# EAGLE design top-v1.0r32 (EAGLE 9.5.2)
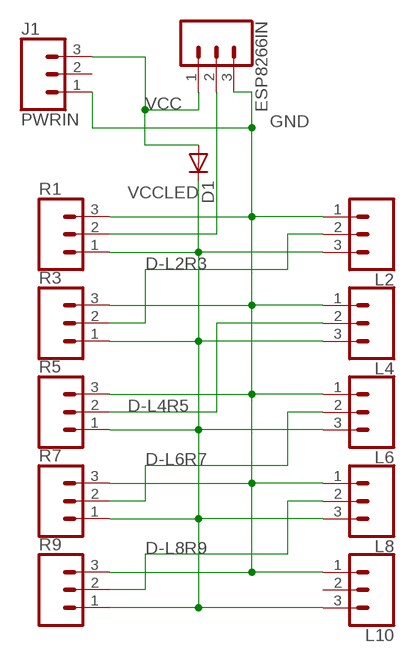
[diagram p0: schematic, sheet 1]

## Parts
D1  1N4004  [DO41-10]
ESP8266IN  CONN_03  [1X03]
J1  PWRIN  CONN_03  [1X03]
L2  CONN_03  [1X03]
L4  CONN_03  [1X03]
L6  CONN_03  [1X03]
L8  CONN_03  [1X03]
L10  CONN_03  [1X03]
R1  CONN_03  [1X03]
R3  CONN_03  [1X03]
R5  CONN_03  [1X03]
R7  CONN_03  [1X03]
R9  CONN_03  [1X03]

## Nets
D-INR1 [DATA]: ESP8266IN.2 R1.2
D-L2R3 [DATA]: L2.2 R3.2
D-L4R5 [DATA]: L4.2 R5.2
D-L6R7 [DATA]: L6.2 R7.2
D-L8R9 [DATA]: L8.2 R9.2
GND [PWR]: ESP8266IN.3 J1.1 L2.1 L4.1 L6.1 L8.1 L10.1 R1.3 R3.3 R5.3 R7.3 R9.3
VCC [PWR]: D1.A ESP8266IN.1 J1.3
VCCLED [PWR]: D1.C L2.3 L4.3 L6.3 L8.3 L10.3 R1.1 R3.1 R5.1 R7.1 R9.1
Unconnected: J1.2 L10.2

## Library data of the parts
D1 = _mod_diode:1N4004: DIODE general purpose rectifier, 1 A
ESP8266IN J1 = SparkFun-Connectors:CONN_03: Multi connection point. Often used as Generic Header-pin footprint for 0.1 inch spaced/style header connections On any of the 0.1 inch spaced packages, you can populate with these: Break Away Headers - Straight <https://www.sparkfun.com/products/116> (PRT-00116) Break Away Male Headers - Right Angle <https://www.sparkfun.com/products/553> (PRT-00553) Female Headers <https://www.sparkfun.com/products/115> (PRT-00115) Break Away Headers - Machine Pin <https://www.sparkfun.com/products/117> (PRT-00117) Break Away Female Headers - Swiss Machine Pin <https://www.sparkfun.com/products/743> (PRT-00743) Stackable Header - 3 Pin (Female, 0.1") <https://www.sparkfun.com/products/13875> (PRT-13875) For SCREWTERMINALS and SPRING TERMINALS visit here: Screw Terimnals on SparkFun.com <https://www.sparkfun.com/search/results?term=Screw+Terminals> (5mm/3.5mm/2.54mm spacing) This device is also useful as a general connection point to wire up your design to another part of your project. Our various solder wires solder well into these plated through hole pads. Hook-Up Wire - Assortment (Stranded, 22 AWG) <https://www.sparkfun.com/products/11375> (PRT-11375) Hook-Up Wire - Assortment (Solid Core, 22 AWG) <https://www.sparkfun.com/products/11367> (PRT-11367) View the entire wire category on our website here <https://www.sparkfun.com/categories/141> Special notes: Molex polarized connector foot print use with SKU : PRT-08232 with associated crimp pins and housings.; PROD_ID: XXX-00000; VALUE: 455-1750-1-ND
L2 L4 L6 L8 L10 R1 R3 R5 R7 R9 = SparkFun-Connectors:CONN_03: Multi connection point. Often used as Generic Header-pin footprint for 0.1 inch spaced/style header connections On any of the 0.1 inch spaced packages, you can populate with these: Break Away Headers - Straight <https://www.sparkfun.com/products/116> (PRT-00116) Break Away Male Headers - Right Angle <https://www.sparkfun.com/products/553> (PRT-00553) Female Headers <https://www.sparkfun.com/products/115> (PRT-00115) Break Away Headers - Machine Pin <https://www.sparkfun.com/products/117> (PRT-00117) Break Away Female Headers - Swiss Machine Pin <https://www.sparkfun.com/products/743> (PRT-00743) Stackable Header - 3 Pin (Female, 0.1") <https://www.sparkfun.com/products/13875> (PRT-13875) For SCREWTERMINALS and SPRING TERMINALS visit here: Screw Terimnals on SparkFun.com <https://www.sparkfun.com/search/results?term=Screw+Terminals> (5mm/3.5mm/2.54mm spacing) This device is also useful as a general connection point to wire up your design to another part of your project. Our various solder wires solder well into these plated through hole pads. Hook-Up Wire - Assortment (Stranded, 22 AWG) <https://www.sparkfun.com/products/11375> (PRT-11375) Hook-Up Wire - Assortment (Solid Core, 22 AWG) <https://www.sparkfun.com/products/11367> (PRT-11367) View the entire wire category on our website here <https://www.sparkfun.com/categories/141> Special notes: Molex polarized connector foot print use with SKU : PRT-08232 with associated crimp pins and housings.

## Net classes
1 PWR: width 1 mm
3 DATA: width 0.5 mm

## Board
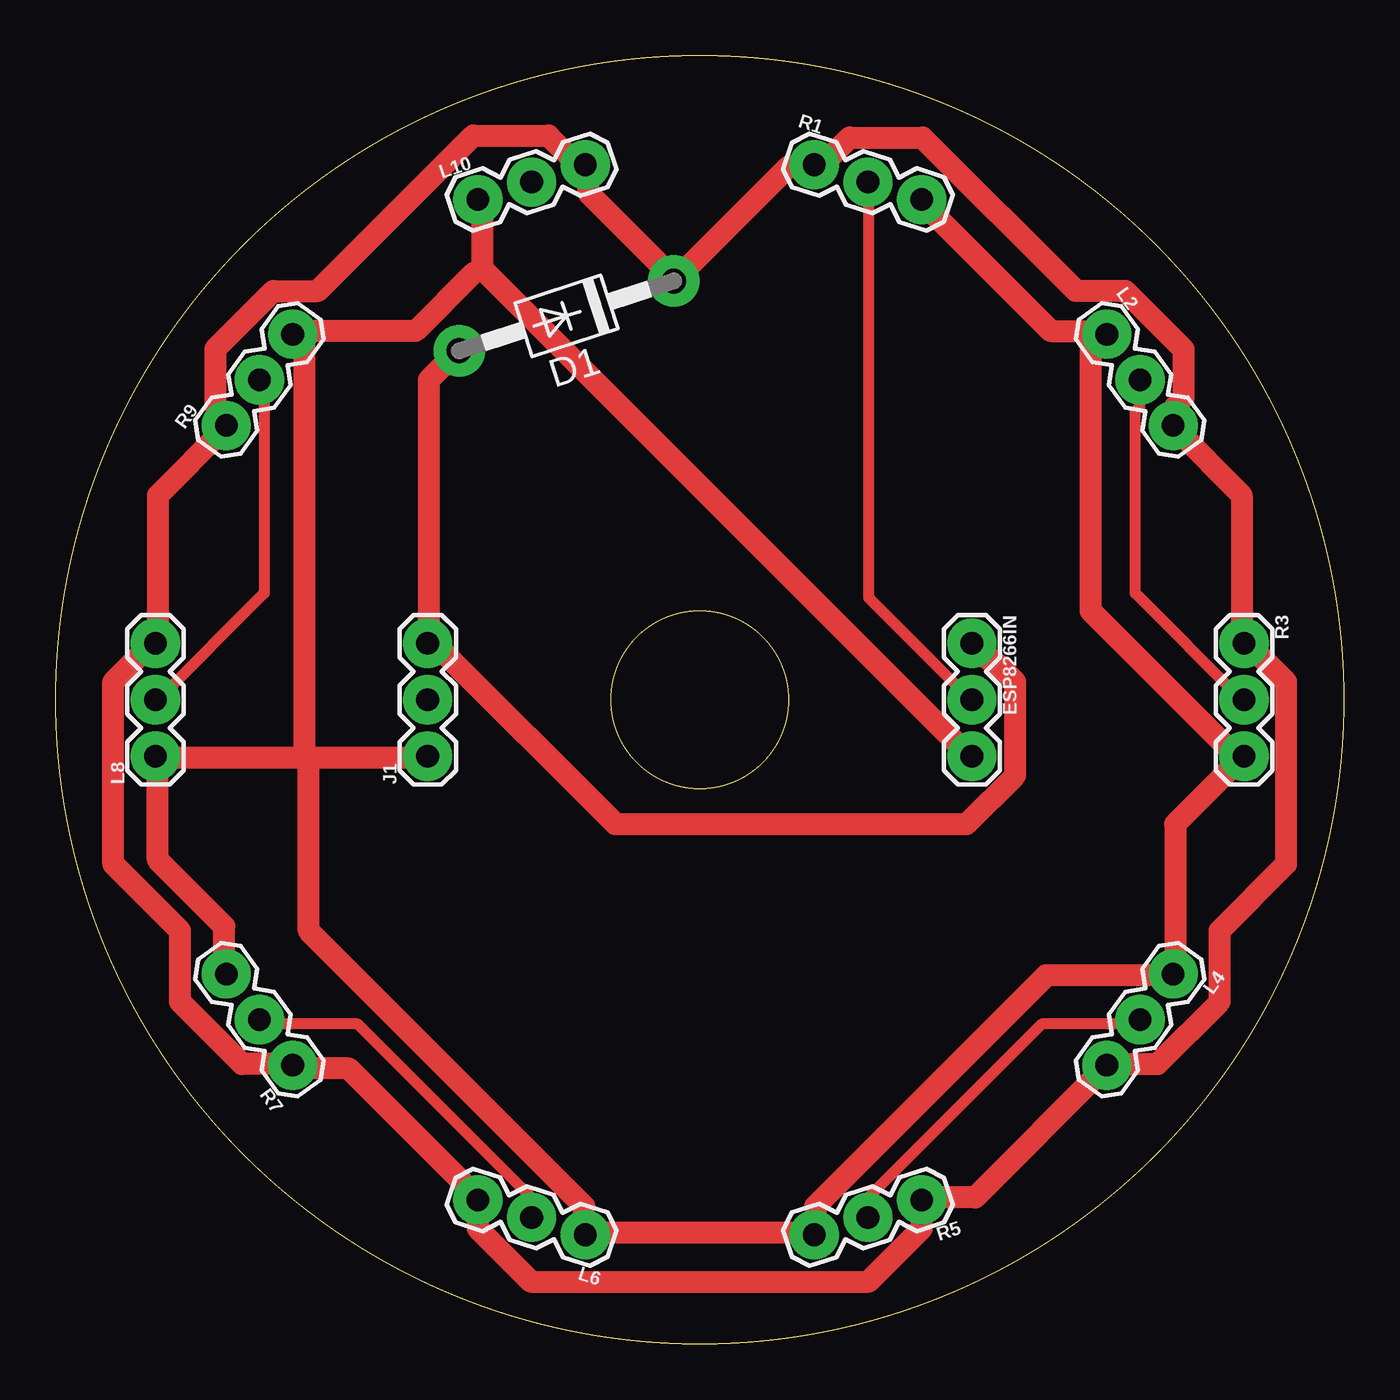
[diagram p1: board, top side]

Size 58 x 58 mm. Coordinates in mm from the lower left corner, seen from the top.
Outline: circle at 29,29 radius 29
Outline: circle at 29,29 radius 4
Copper layers 1: Top 0.035mm
Design rules "default *": minimum track width 0.3mm, minimum drill 1mm, track to track 0.5mm, track to pad 0.25mm, pad to pad 0.15mm, via to via 0.25mm, smd to smd 0.05mm, copper to edge 40mil, drill to drill 6mil, minimum pad ring 0.6mm, minimum via ring 8mil, stop-mask expansion 4mil, vias tented up to drill 0mil, thermal gap 10mil

### Footprints (pad centres in the part's own frame; a part is rotated, then mirrored left to right if it is on the bottom)
DO41-10 = drill 1.118: A 5.08,0; C -5.08,0
1X03 = drill 1.016 pad 1.88: 1 0,0; 2 2.54,0; 3 5.08,0

### Placement (x,y rotation side)
D1  23,46.28 198 top
ESP8266IN  41.25,31.54 270 top
J1  16.75,26.46 90 top
L2  47.33,45.46 306 top
L4  50.31,16.65 234 top
L6  23.84,4.91 162 top
L8  4.5,26.46 90 top
L10  19.01,51.52 18 top
R1  34.16,53.09 342 top
R3  53.5,31.54 270 top
R5  38.99,6.48 198 top
R7  10.67,12.54 126 top
R9  7.69,41.35 54 top

### Tracks (layer width: path | path; a pad name or v marks a point on that pad's centre or on a via)
D-INR1
  Top 0.5: ESP8266IN.2 41.2,29 36.6,33.6 36.6,52.2 R1.2
D-L2R3
  Top 0.5: L2.2 48.8,43.4 48.8,42.2 48.6,42 48.6,33.8 53.4,29 R3.2
D-L4R5
  Top 0.5: R5.2 36.6,5.8 36.6,6.6 44.4,14.4 48.8,14.4 L4.2
D-L6R7
  Top 0.5: R7.2 9.2,14.4 13.6,14.4 21.4,6.6 21.4,5.8 L6.2
D-L8R9
  Top 0.5: L8.2 4.6,29 9.4,33.8 9.4,43.2 9.2,43.4 R9.2
GND
  Top 1: R7.3 7.6,16.8 7.6,18.8 4.6,21.8 4.6,26.4 L8.1 5,26.4 11.2,26.4 | 11.2,26.4 11.4,26.4 | 11.4,26.4 16.6,26.4 J1.1 | 19.2,48.4 40.6,27 40.8,27 41.2,26.6 ESP8266IN.3 | 19.2,48.4 19.2,51.4 L10.1 | 19.2,48.4 18.8,48.2 16.2,45.6 10.8,45.6 R9.3 11.2,45.2 11.2,26.4 | R1.3 39,51.4 44.8,45.6 47.2,45.6 L2.1 46.6,45.2 46.6,33 53,26.6 R3.3 53.4,26.4 50.4,23.4 50.4,16.8 L4.1 50,16.6 44.6,16.6 34.2,6.2 34.2,5.4 R5.3 34,5 24,5 L6.1 23.8,5.4 23.8,6.2 11.4,18.6 11.4,26.4
VCC
  Top 1: D1.A 18,44.6 16.8,43.4 16.8,31.6 J1.3 17.2,31.4 25.2,23.4 41,23.4 43.2,25.6 43.2,29.8 42.2,30.8 42,30.8 41.4,31.4 ESP8266IN.1
VCCLED
  Top 1: 50.4,41.2 53.4,38.2 53.4,31.6 R3.1 53.8,31.2 54,31.2 55.4,29.8 55.4,21.6 52.4,18.6 52.4,15.4 49.6,12.6 47.8,12.6 L4.3 47.2,12.4 41.4,6.6 39,6.6 R5.1 39,6 39,5.2 36.6,2.8 21.4,2.8 19,5.2 19,6 L6.3 19,6.6 13.2,12.4 10.8,12.4 R7.1 10.2,12.6 8.4,12.6 5.6,15.4 5.6,18.6 2.6,21.6 2.6,29.8 4,31.2 4.2,31.2 L8.3 4.6,31.6 4.6,38.2 7.6,41.2 R9.1 7.6,41.8 7.2,42.2 7.2,44.8 9.8,47.4 11.8,47.4 18.8,54.4 22.2,54.4 23.4,53.2 L10.3 24,53 24,51.8 27.8,48 D1.C 28.2,48.2 33,53 34,53 R1.1 34.52,53.09 35.74,54.31 39.03,54.31 45.93,47.41 48.14,47.41 50.78,44.77 50.78,42.59 50.4,42.21 50.4,41.2 | 50.4,41.2 L2.3